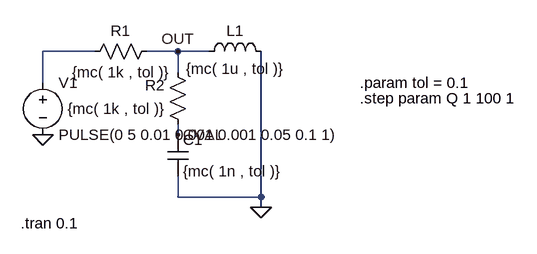
[diagram p0: schematic cir.asc]
cir.asc, the LTspice schematic file:
Version 4
SHEET 1 880 680
WIRE 112 48 32 48
WIRE 240 48 192 48
WIRE 288 48 240 48
WIRE 240 80 240 48
WIRE 32 96 32 48
WIRE 240 176 240 160
WIRE 240 272 240 240
WIRE 368 272 368 48
WIRE 368 272 240 272
WIRE 368 288 368 272
FLAG 32 176 0
FLAG 368 288 0
FLAG 240 48 OUT
FLAG 240 176 CVAL
SYMBOL voltage 32 80 R0
WINDOW 123 0 0 Left 0
WINDOW 39 0 0 Left 0
SYMATTR InstName V1
SYMATTR Value PULSE(0 5 0.01 0.001 0.001 0.05 0.1 1)
SYMBOL res 208 32 R90
WINDOW 0 0 56 VBottom 2
WINDOW 3 32 56 VTop 2
SYMATTR InstName R1
SYMATTR Value {mc( 1k , tol )}
SYMBOL res 256 176 R180
WINDOW 0 36 76 Left 2
WINDOW 3 36 40 Left 2
SYMATTR InstName R2
SYMATTR Value {mc( 1k , tol )}
SYMBOL cap 224 176 R0
SYMATTR InstName C1
SYMATTR Value {mc( 1n , tol )}
SYMBOL ind 272 64 R270
WINDOW 0 32 56 VTop 2
WINDOW 3 5 56 VBottom 2
SYMATTR InstName L1
SYMATTR Value {mc( 1u , tol )}
TEXT 520 96 Left 2 !.param tol = 0.1
TEXT 520 120 Left 2 !.step param Q 1 100 1
TEXT -2 312 Left 2 !.tran 0.1

The netlist it stands for:
* cir.asc
V1 N001 0 PULSE(0 5 0.01 0.001 0.001 0.05 0.1 1)
R1 OUT N001 {mc( 1k , tol )}
R2 CVAL OUT {mc( 1k , tol )}
C1 CVAL 0 {mc( 1n , tol )}
L1 OUT 0 {mc( 1u , tol )}
.param tol = 0.1
.step param Q 1 100 1
.tran 0.1
.backanno
.end